# Altium schematic sheet OK6010_DB_pwr_bgt.SchDoc
size A
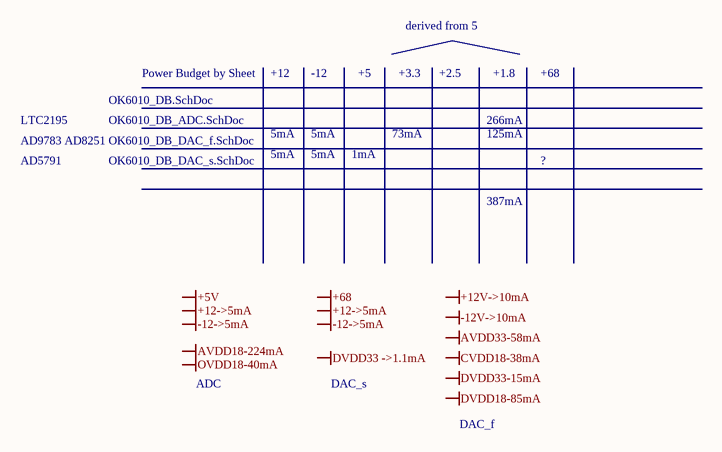
[diagram p0: OK6010_DB_pwr_bgt.SchDoc]

## Notes on the sheet
- Power Budget by Sheet
- +12
- -12
- +5
- +3.3
- derived from 5
- +2.5
- +1.8
- +68
- LTC2195
- OK6010_DB.SchDoc
- OK6010_DB_ADC.SchDoc
- 5mA
- 73mA
- 266mA
- 125mA
- AD9783 AD8251
- AD5791
- OK6010_DB_DAC_f.SchDoc
- OK6010_DB_DAC_s.SchDoc
- 1mA
- 387mA
- ?
- ADC
- DAC_s
- DAC_f
- Labels drawn without touching a wire or pin: +5V, +12->5mA, +12V->10mA, +68, -12->5mA, -12V->10mA, AVDD18-224mA, AVDD33-58mA, CVDD18-38mA, DVDD18-85mA, DVDD33 ->1.1mA, DVDD33-15mA, OVDD18-40mA